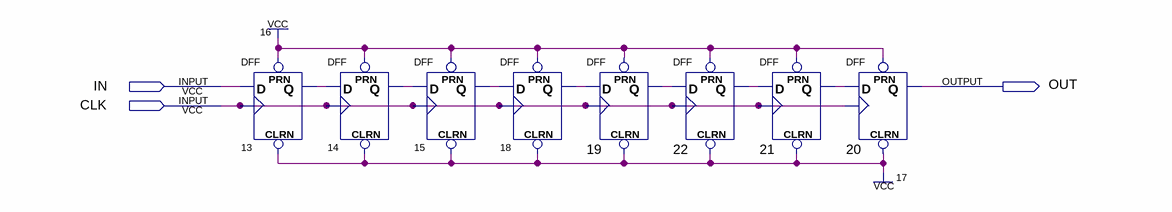
[diagram p0: schematic sheet]
// Quartus schematic sr8.bdf as structural Verilog: 8 symbols, 3 pins
module sr8 (
  input  IN,
  input  CLK,
  output OUT
);

  wire n13_q, n14_q, n15_q, n18_q, n19_q, n21_q, n22_q;

  DFF u_13 (.CLRN(1'b1), .CLK(CLK), .D(IN), .PRN(1'b1), .Q(n13_q));
  DFF u_14 (.CLRN(1'b1), .CLK(CLK), .D(n13_q), .PRN(1'b1), .Q(n14_q));
  DFF u_15 (.CLRN(1'b1), .CLK(CLK), .D(n14_q), .PRN(1'b1), .Q(n15_q));
  DFF u_18 (.CLRN(1'b1), .CLK(CLK), .D(n15_q), .PRN(1'b1), .Q(n18_q));
  DFF u_19 (.CLRN(1'b1), .CLK(CLK), .D(n18_q), .PRN(1'b1), .Q(n19_q));
  DFF u_22 (.CLRN(1'b1), .CLK(CLK), .D(n19_q), .PRN(1'b1), .Q(n22_q));
  DFF u_21 (.CLRN(1'b1), .CLK(CLK), .D(n22_q), .PRN(1'b1), .Q(n21_q));
  DFF u_20 (.CLRN(1'b1), .CLK(CLK), .D(n21_q), .PRN(1'b1), .Q(OUT));
endmodule
